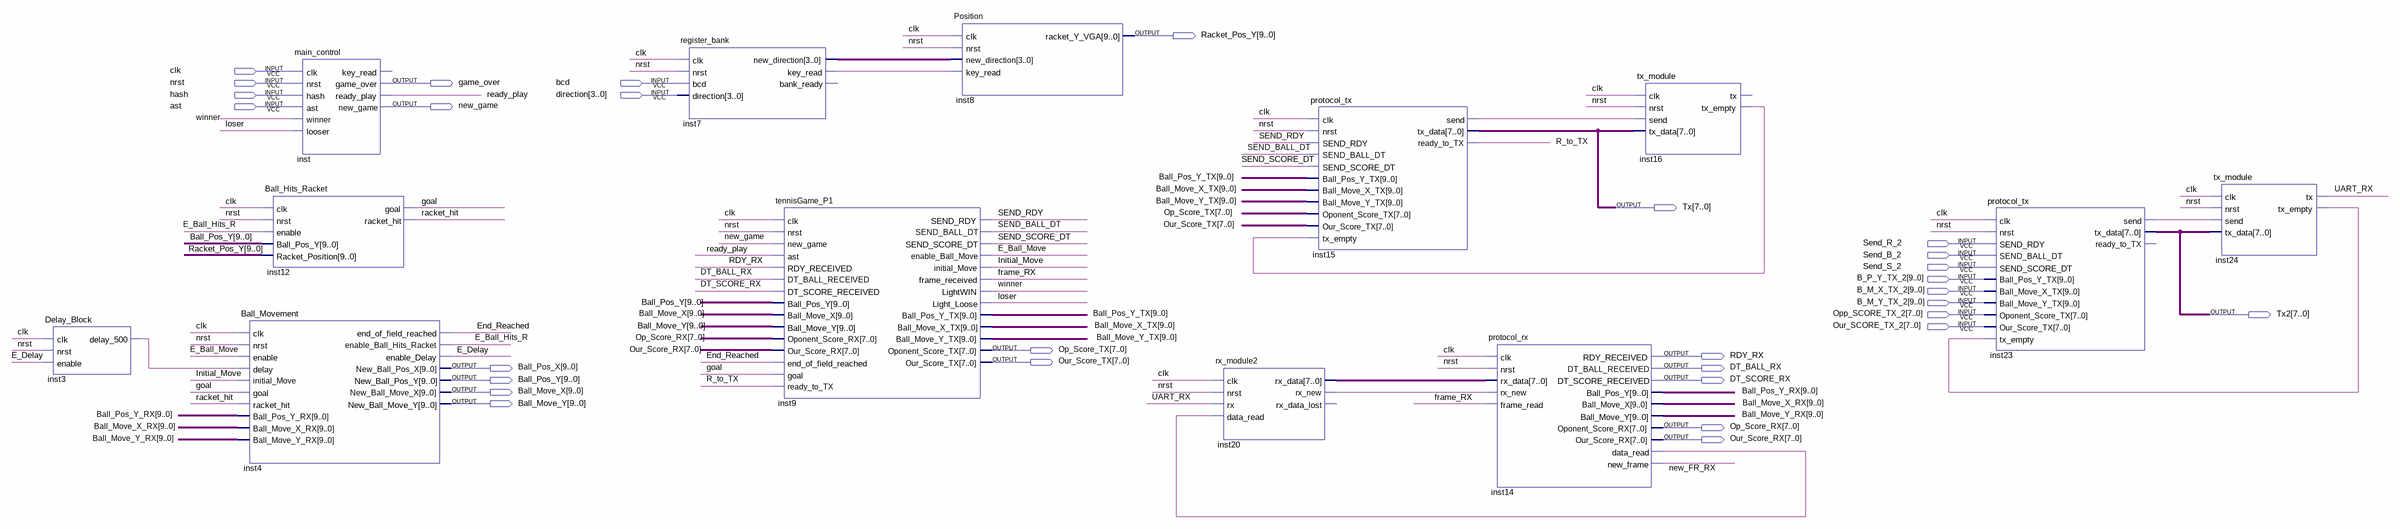
[diagram p0: schematic sheet]
// Quartus schematic Game_P1_Demo.bdf as structural Verilog: 13 symbols, 30 pins
module Game_P1_Demo (
  input  clk,
  input  nrst,
  input  bcd,
  input  hash,
  input  [3:0] direction,
  input  ast,
  input  Send_R_2,
  input  Send_B_2,
  input  Send_S_2,
  input  [9:0] B_P_Y_TX_2,
  input  [9:0] B_M_X_TX_2,
  input  [9:0] B_M_Y_TX_2,
  input  [7:0] Opp_SCORE_TX_2,
  input  [7:0] Our_SCORE_TX_2,
  output [9:0] Racket_Pos_Y,
  output game_over,
  output new_game,
  output [7:0] Tx,
  output [7:0] Tx2,
  output [7:0] Op_Score_TX,
  output RDY_RX,
  output [7:0] Our_Score_TX,
  output [9:0] Ball_Pos_X,
  output DT_BALL_RX,
  output [9:0] Ball_Pos_Y,
  output DT_SCORE_RX,
  output [9:0] Ball_Move_X,
  output [9:0] Ball_Move_Y,
  output [7:0] Op_Score_RX,
  output [7:0] Our_Score_RX
);

  wire E_Ball_Hits_R, E_Ball_Move, E_Delay, End_Reached, frame_RX, goal, Initial_Move, inst3_delay_500,
       inst7_key_read, inst14_data_read, inst15_send, inst16_tx_empty, inst20_rx_new, inst23_send,
       inst24_tx_empty, loser, new_FR_RX, R_to_TX, racket_hit, ready_play, SEND_BALL_DT, SEND_RDY,
       SEND_SCORE_DT, UART_RX, winner;
  wire [3:0] inst7_new_direction;
  wire [7:0] inst20_rx_data;
  wire [9:0] Ball_Move_X_RX, Ball_Move_X_TX, Ball_Move_Y_RX, Ball_Move_Y_TX, Ball_Pos_Y_RX, Ball_Pos_Y_TX;

  Delay_Block inst3 (.clk(clk), .nrst(nrst), .enable(E_Delay), .delay_500(inst3_delay_500));
  Ball_Hits_Racket inst12 (
    .clk(clk), .nrst(nrst), .enable(E_Ball_Hits_R), .Ball_Pos_Y(Ball_Pos_Y), .Racket_Position(Racket_Pos_Y),
    .goal(goal), .racket_hit(racket_hit));
  Ball_Movement inst4 (
    .clk(clk), .nrst(nrst), .enable(E_Ball_Move), .delay(inst3_delay_500), .initial_Move(Initial_Move),
    .goal(goal), .racket_hit(racket_hit), .Ball_Pos_Y_RX(Ball_Pos_Y_RX), .Ball_Move_X_RX(Ball_Move_X_RX),
    .Ball_Move_Y_RX(Ball_Move_Y_RX), .end_of_field_reached(End_Reached),
    .enable_Ball_Hits_Racket(E_Ball_Hits_R), .enable_Delay(E_Delay), .New_Ball_Pos_X(Ball_Pos_X),
    .New_Ball_Pos_Y(Ball_Pos_Y), .New_Ball_Move_X(Ball_Move_X), .New_Ball_Move_Y(Ball_Move_Y));
  main_control inst (
    .clk(clk), .nrst(nrst), .hash(hash), .ast(ast), .winner(winner), .looser(loser), .game_over(game_over),
    .ready_play(ready_play), .new_game(new_game));  // open: key_read
  register_bank inst7 (
    .clk(clk), .nrst(nrst), .bcd(bcd), .direction(direction), .new_direction(inst7_new_direction),
    .key_read(inst7_key_read));  // open: bank_ready
  tennisGame_P1 inst9 (
    .clk(clk), .nrst(nrst), .new_game(new_game), .ast(ready_play), .RDY_RECEIVED(RDY_RX),
    .DT_BALL_RECEIVED(DT_BALL_RX), .DT_SCORE_RECEIVED(DT_SCORE_RX), .Ball_Pos_Y(Ball_Pos_Y),
    .Ball_Move_X(Ball_Move_X), .Ball_Move_Y(Ball_Move_Y), .Oponent_Score_RX(Op_Score_RX),
    .Our_Score_RX(Our_Score_RX), .end_of_field_reached(End_Reached), .goal(goal), .ready_to_TX(R_to_TX),
    .SEND_RDY(SEND_RDY), .SEND_BALL_DT(SEND_BALL_DT), .SEND_SCORE_DT(SEND_SCORE_DT),
    .enable_Ball_Move(E_Ball_Move), .initial_Move(Initial_Move), .frame_received(frame_RX),
    .LightWIN(winner), .Light_Loose(loser), .Ball_Pos_Y_TX(Ball_Pos_Y_TX), .Ball_Move_X_TX(Ball_Move_X_TX),
    .Ball_Move_Y_TX(Ball_Move_Y_TX), .Oponent_Score_TX(Op_Score_TX), .Our_Score_TX(Our_Score_TX));
  Position inst8 (
    .clk(clk), .nrst(nrst), .new_direction(inst7_new_direction), .key_read(inst7_key_read),
    .racket_Y_VGA(Racket_Pos_Y));
  rx_module2 inst20 (
    .clk(clk), .nrst(nrst), .rx(UART_RX), .data_read(inst14_data_read), .rx_data(inst20_rx_data),
    .rx_new(inst20_rx_new));  // open: rx_data_lost
  protocol_tx inst15 (
    .clk(clk), .nrst(nrst), .SEND_RDY(SEND_RDY), .SEND_BALL_DT(SEND_BALL_DT), .SEND_SCORE_DT(SEND_SCORE_DT),
    .Ball_Pos_Y_TX(Ball_Pos_Y_TX), .Ball_Move_X_TX(Ball_Move_X_TX), .Ball_Move_Y_TX(Ball_Move_Y_TX),
    .Oponent_Score_TX(Op_Score_TX), .Our_Score_TX(Our_Score_TX), .tx_empty(inst16_tx_empty),
    .send(inst15_send), .tx_data(Tx), .ready_to_TX(R_to_TX));
  protocol_rx inst14 (
    .clk(clk), .nrst(nrst), .rx_data(inst20_rx_data), .rx_new(inst20_rx_new), .frame_read(frame_RX),
    .RDY_RECEIVED(RDY_RX), .DT_BALL_RECEIVED(DT_BALL_RX), .DT_SCORE_RECEIVED(DT_SCORE_RX),
    .Ball_Pos_Y(Ball_Pos_Y_RX), .Ball_Move_X(Ball_Move_X_RX), .Ball_Move_Y(Ball_Move_Y_RX),
    .Oponent_Score_RX(Op_Score_RX), .Our_Score_RX(Our_Score_RX), .data_read(inst14_data_read),
    .new_frame(new_FR_RX));
  tx_module inst16 (.clk(clk), .nrst(nrst), .send(inst15_send), .tx_data(Tx), .tx_empty(inst16_tx_empty));  // open: tx
  protocol_tx inst23 (
    .clk(clk), .nrst(nrst), .SEND_RDY(Send_R_2), .SEND_BALL_DT(Send_B_2), .SEND_SCORE_DT(Send_S_2),
    .Ball_Pos_Y_TX(B_P_Y_TX_2), .Ball_Move_X_TX(B_M_X_TX_2), .Ball_Move_Y_TX(B_M_Y_TX_2),
    .Oponent_Score_TX(Opp_SCORE_TX_2), .Our_Score_TX(Our_SCORE_TX_2), .tx_empty(inst24_tx_empty),
    .send(inst23_send), .tx_data(Tx2));  // open: ready_to_TX
  tx_module inst24 (
    .clk(clk), .nrst(nrst), .send(inst23_send), .tx_data(Tx2), .tx(UART_RX), .tx_empty(inst24_tx_empty));
endmodule
